# Altium schematic sheet Power_supply.SchDoc
size 420 x 297 mm; Address1: Address1; Address2: Address2; Address3: Address3; Address4: Address4; DocumentNumber: *Э3; SheetNumber: 4; SheetTotal: 11; DocumentType: Схема электрическая *
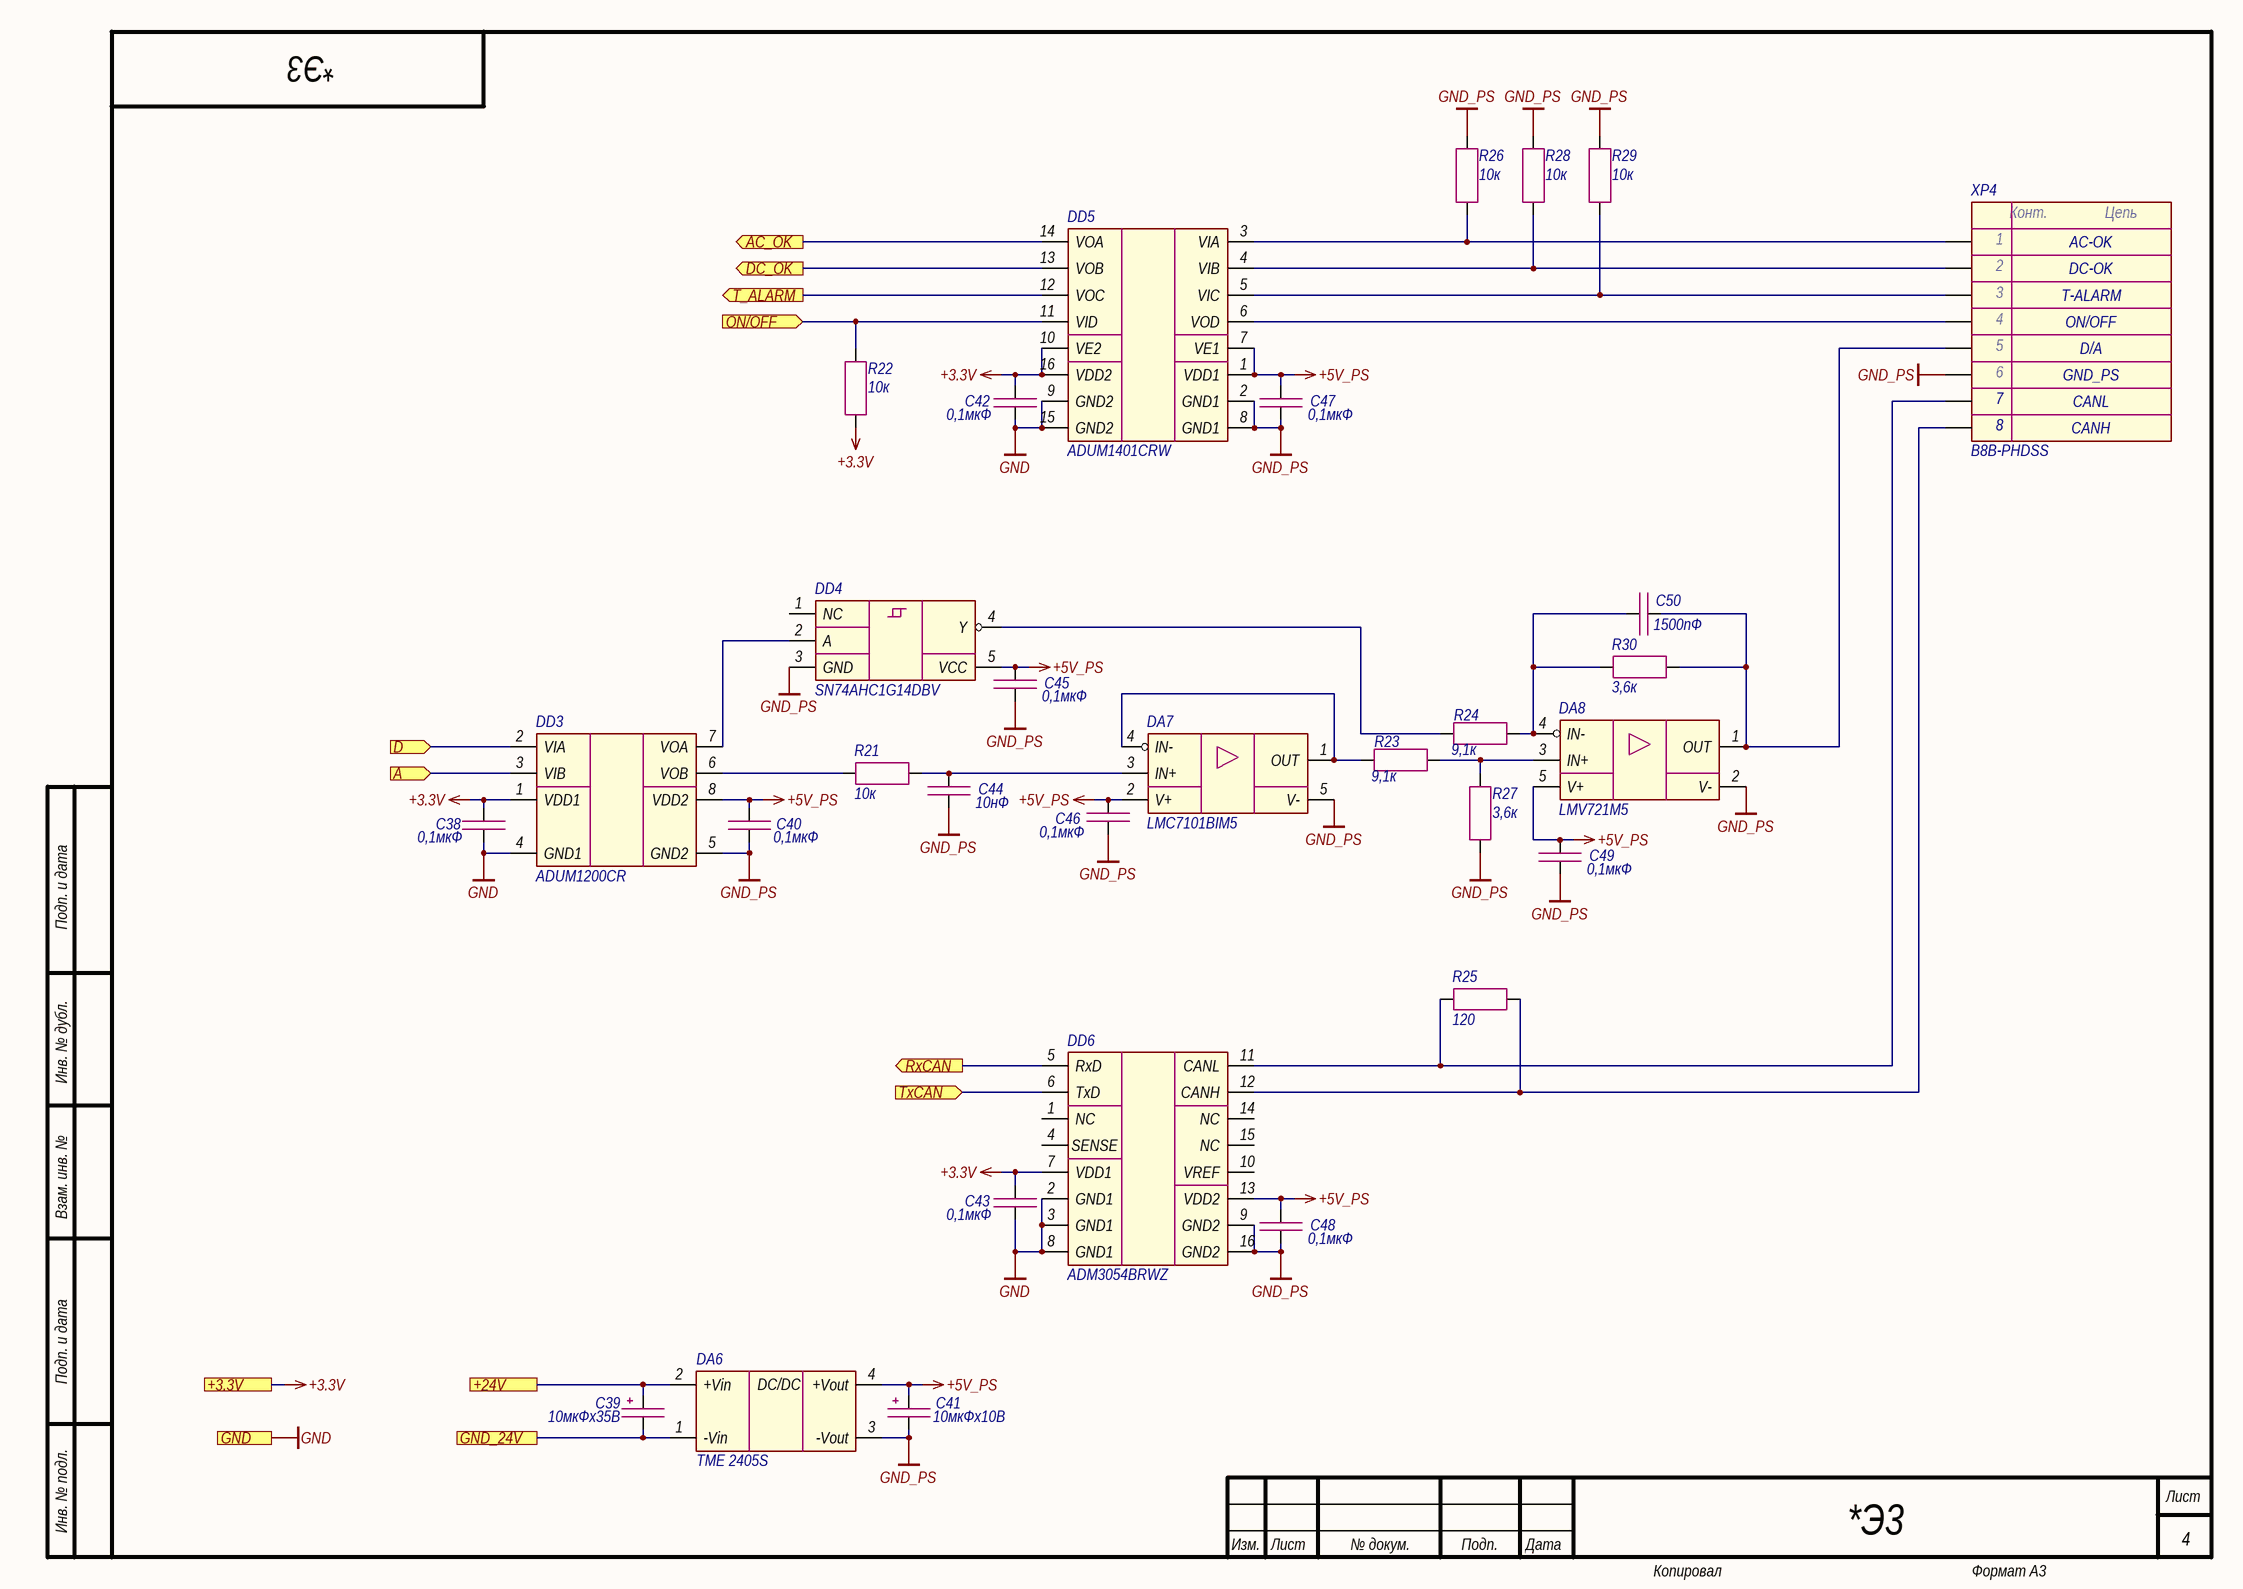
[diagram p0: Power_supply.SchDoc]

## Parts
C38  0,1мкФ  [CAP_0603]
C39  10мкФх35B  [CAP_C]
C40  0,1мкФ  [CAP_0603]
C41  10мкФх10B  [CAP_A]
C42  0,1мкФ  [CAP_0603]
C43  0,1мкФ  [CAP_0603]
C44  10нФ  [CAP_0603]
C45  0,1мкФ  [CAP_0603]
C46  0,1мкФ  [CAP_0603]
C47  0,1мкФ  [CAP_0603]
C48  0,1мкФ  [CAP_0603]
C49  0,1мкФ  [CAP_0603]
C50  1500пФ  [CAP_0603]
DA6  TME 2405S  [TME (SIP-4)]
DA7  LMC7101BIM5  [SOT-23-5]
DA8  LMV721M5  [SOT-23-5]
DD3  ADUM1200CR  [SOIC-8]
DD4  SN74AHC1G14DBV  [SOT-23-5]
DD5  ADUM1401CRW  [SOIC-16W]
DD6  ADM3054BRWZ  [SOIC-16W]
R21  10к  [RES_0603]
R22  10к  [RES_0603]
R23  9,1к  [RES_0603]
R24  9,1к  [RES_0603]
R25  120  [RES_0603]
R26  10к  [RES_0603]
R27  3,6к  [RES_0603]
R28  10к  [RES_0603]
R29  10к  [RES_0603]
R30  3,6к  [RES_0603]
XP4  B8B-PHDSS  [B8B-PHDSS]

## Ports
+3.3V (see Main[2B], Ethernet[3D], Fiber_interlock[2C], Flow_sensor[2C], Hardwiring[3D], LD_driver[1D]), +24V (see Main[1B], Flow_sensor[2C], Hardwiring[3C], Indication[1C], LD_driver[1D]), A (in, see Main[1B]), AC_OK (out, see Main[2B]), D (in, see Main[1B]), DC_OK (out, see Main[2B]), GND (see Main[2C], Ethernet[3D], Fiber_interlock[2C], Flow_sensor[2C], Guide_laser[1C], Hardwiring[3D], Indication[1C], LD_driver[1D]), GND_24V (see Main[1B], Flow_sensor[2C], Hardwiring[3C], Indication[1C], LD_driver[1D]), ON/OFF (in, see Main[1B]), RxCAN (out, see Main[2B]), T_ALARM (out, see Main[2B]), TxCAN (in, see Main[2B])

## Nets
+3.3V: C38.1 C42.1 C43.1 DD3.1(VDD1) DD5.10(VE2) DD5.16(VDD2) DD6.7(VDD1) R22.1 ; port +3.3V
+5V_PS: C40.1 C41.1 C45.1 C46.1 C47.1 C48.1 C49.1 DA6.4(+Vout) DA7.2(V+) DA8.5(V+) DD3.8(VDD2) DD4.5(VCC) DD5.1(VDD1) DD5.7(VE1) DD6.13(VDD2)
GND: C38.2 C42.2 C43.2 DD3.4(GND1) DD5.9(GND2) DD5.15(GND2) DD6.2(GND1) DD6.3(GND1) DD6.8(GND1) ; port GND
GND_PS: C40.2 C41.2 C44.2 C45.2 C46.2 C47.2 C48.2 C49.2 DA6.3(-Vout) DA7.5(V-) DA8.2(V-) DD3.5(GND2) DD4.3(GND) DD5.2(GND1) DD5.8(GND1) DD6.9(GND2) DD6.16(GND2) R26.1 R27.2 R28.1 R29.1 XP4.6
+24V: C39.1 DA6.2(+Vin) ; port +24V
A: DD3.3(VIB) ; port A
AC_OK: DD5.14(VOA) ; port AC_OK
D: DD3.2(VIA) ; port D
DC_OK: DD5.13(VOB) ; port DC_OK
GND_24V: C39.2 DA6.1(-Vin) ; port GND_24V
ON/OFF: DD5.11(VID) R22.2 ; port ON/OFF
RxCAN: DD6.5(RxD) ; port RxCAN
T_ALARM: DD5.12(VOC) ; port T_ALARM
TxCAN: DD6.6(TxD) ; port TxCAN
NetC44_1: C44.1 DA7.3(IN+) R21.2
NetC50_1: C50.1 DA8.4(IN-) R24.1 R30.2
NetC50_2: C50.2 DA8.1(OUT) R30.1 XP4.5
NetDA7_1: DA7.1(OUT) DA7.4(IN-) R23.2
NetDA8_3: DA8.3(IN+) R23.1 R27.1
NetDD3_6: DD3.6(VOB) R21.1
NetDD3_7: DD3.7(VOA) DD4.2(A)
NetDD4_4: DD4.4(Y) R24.2
NetDD5_3: DD5.3(VIA) R26.2 XP4.1
NetDD5_4: DD5.4(VIB) R28.2 XP4.2
NetDD5_5: DD5.5(VIC) R29.2 XP4.3
NetDD5_6: DD5.6(VOD) XP4.4
NetDD6_11: DD6.11(CANL) R25.1 XP4.7
NetDD6_12: DD6.12(CANH) R25.2 XP4.8

Not connected (* = marked no-connect by the designer): DD4 1(NC); DD6 1(NC) 4(SENSE) 10(VREF) 14(NC) 15(NC)

## Notes on the sheet
- AC-OK
- DC-OK
- T-ALARM
- ON/OFF
- CANL
- GND_PS
- D/A
- CANH
- Подп. и дата
- Инв. № дубл.
- Взам. инв. №
- Инв. № подл.
- Изм.
- Лист
- № докум.
- Подп.
- Дата
- Копировал
- Формат А3
- (in symbol Connector-8) Конт.; Цепь
- (in symbol TME) DC/DC

## Library data of the parts
C38 C40 C42 C43 C45-C49 = Capacitor: Manufacturer: Murata; Model: GRM188R71H104KA93D; Value: 0,1мкФ; Document: *
C39 = Capacitor_Polar: Model: TECAP, 10 мкФ, 35 В, тип C, 10%; Value: 10мкФх35B; Document: *; Manufacturer: *
C41 = Capacitor_Polar: Model: TECAP, 10 мкФ, 10 В, тип A, 10%; Value: 10мкФх10B; Document: *; Manufacturer: *
C44 = Capacitor: Manufacturer: Murata; Model: GRM188R71H103JA01D; Value: 10нФ; Document: *
C50 = Capacitor: Manufacturer: Murata; Model: GRM188R71H152KA01D; Value: 1500пФ; Document: *
DA6 = TME: Manufacturer: Traco Power; Model: TME 2405S; Document: *
DA7 = LMC7101: Manufacturer: Texas Instruments; Model: LMC7101BIM5; Document: *
DA8 = LMV721M5: Manufacturer: Texas Instruments; Model: LMV721M5; Document: *
DD3 = ADUM1200: Manufacturer: Analog Devices; Model: ADUM1200CR; Document: *
DD4 = SN74AHC1G14: Manufacturer: Texas Instruments; Model: SN74AHC1G14DBV; Document: *
DD5 = ADUM1401: Manufacturer: Analog Devices; Model: ADUM1401CRW; Document: *
DD6 = ADM3054BRWZ: Manufacturer: Analog Devices; Model: ADM3054BRWZ; Document: *
R21 R22 R26 R28 R29 = Resistor: Manufacturer: Yageo; Model: RC0603FR-0710KL; Value: 10к; Document: *
R23 R24 = Resistor: Manufacturer: Yageo; Model: RC0603FR-079K1L; Value: 9,1к; Document: *
R25 = Resistor: Manufacturer: Yageo; Model: RC0603FR-07120RL; Value: 120; Document: *
R27 R30 = Resistor: Manufacturer: Yageo; Model: RC0603FR-073K6L; Value: 3,6к; Document: *
XP4 = Connector-8: Manufacturer: JST; Model: B8B-PHDSS; Document: *